# Altium schematic sheet BG1094_USB.SchDoc: =project_title
size Tabloid; PageSetup: Record=PageOptions|CenterHorizontal=True|CenterVertical=True|PrintScale=0.73|XCorrection=1.00|YCorrection=1.00|PrintKind=0|BorderSize=5000000|LeftOffset=0|BottomOffset=0|Orientation=2|PaperLength=1000|PaperWidth=1000|Scale=100|PaperSource=7|PrintQuality=-4|MediaType=1|DitherType=10|PaperKind=A4|PrintScaleMode=1; CompanyName: Luxonis Holding; Organization: Luxonis Holding; Address1: 1925 Harmony Park Drive; Address2: Westminster, CO; Address3: 80234; Address4: United States; SheetNumber: 4; SheetTotal: 5
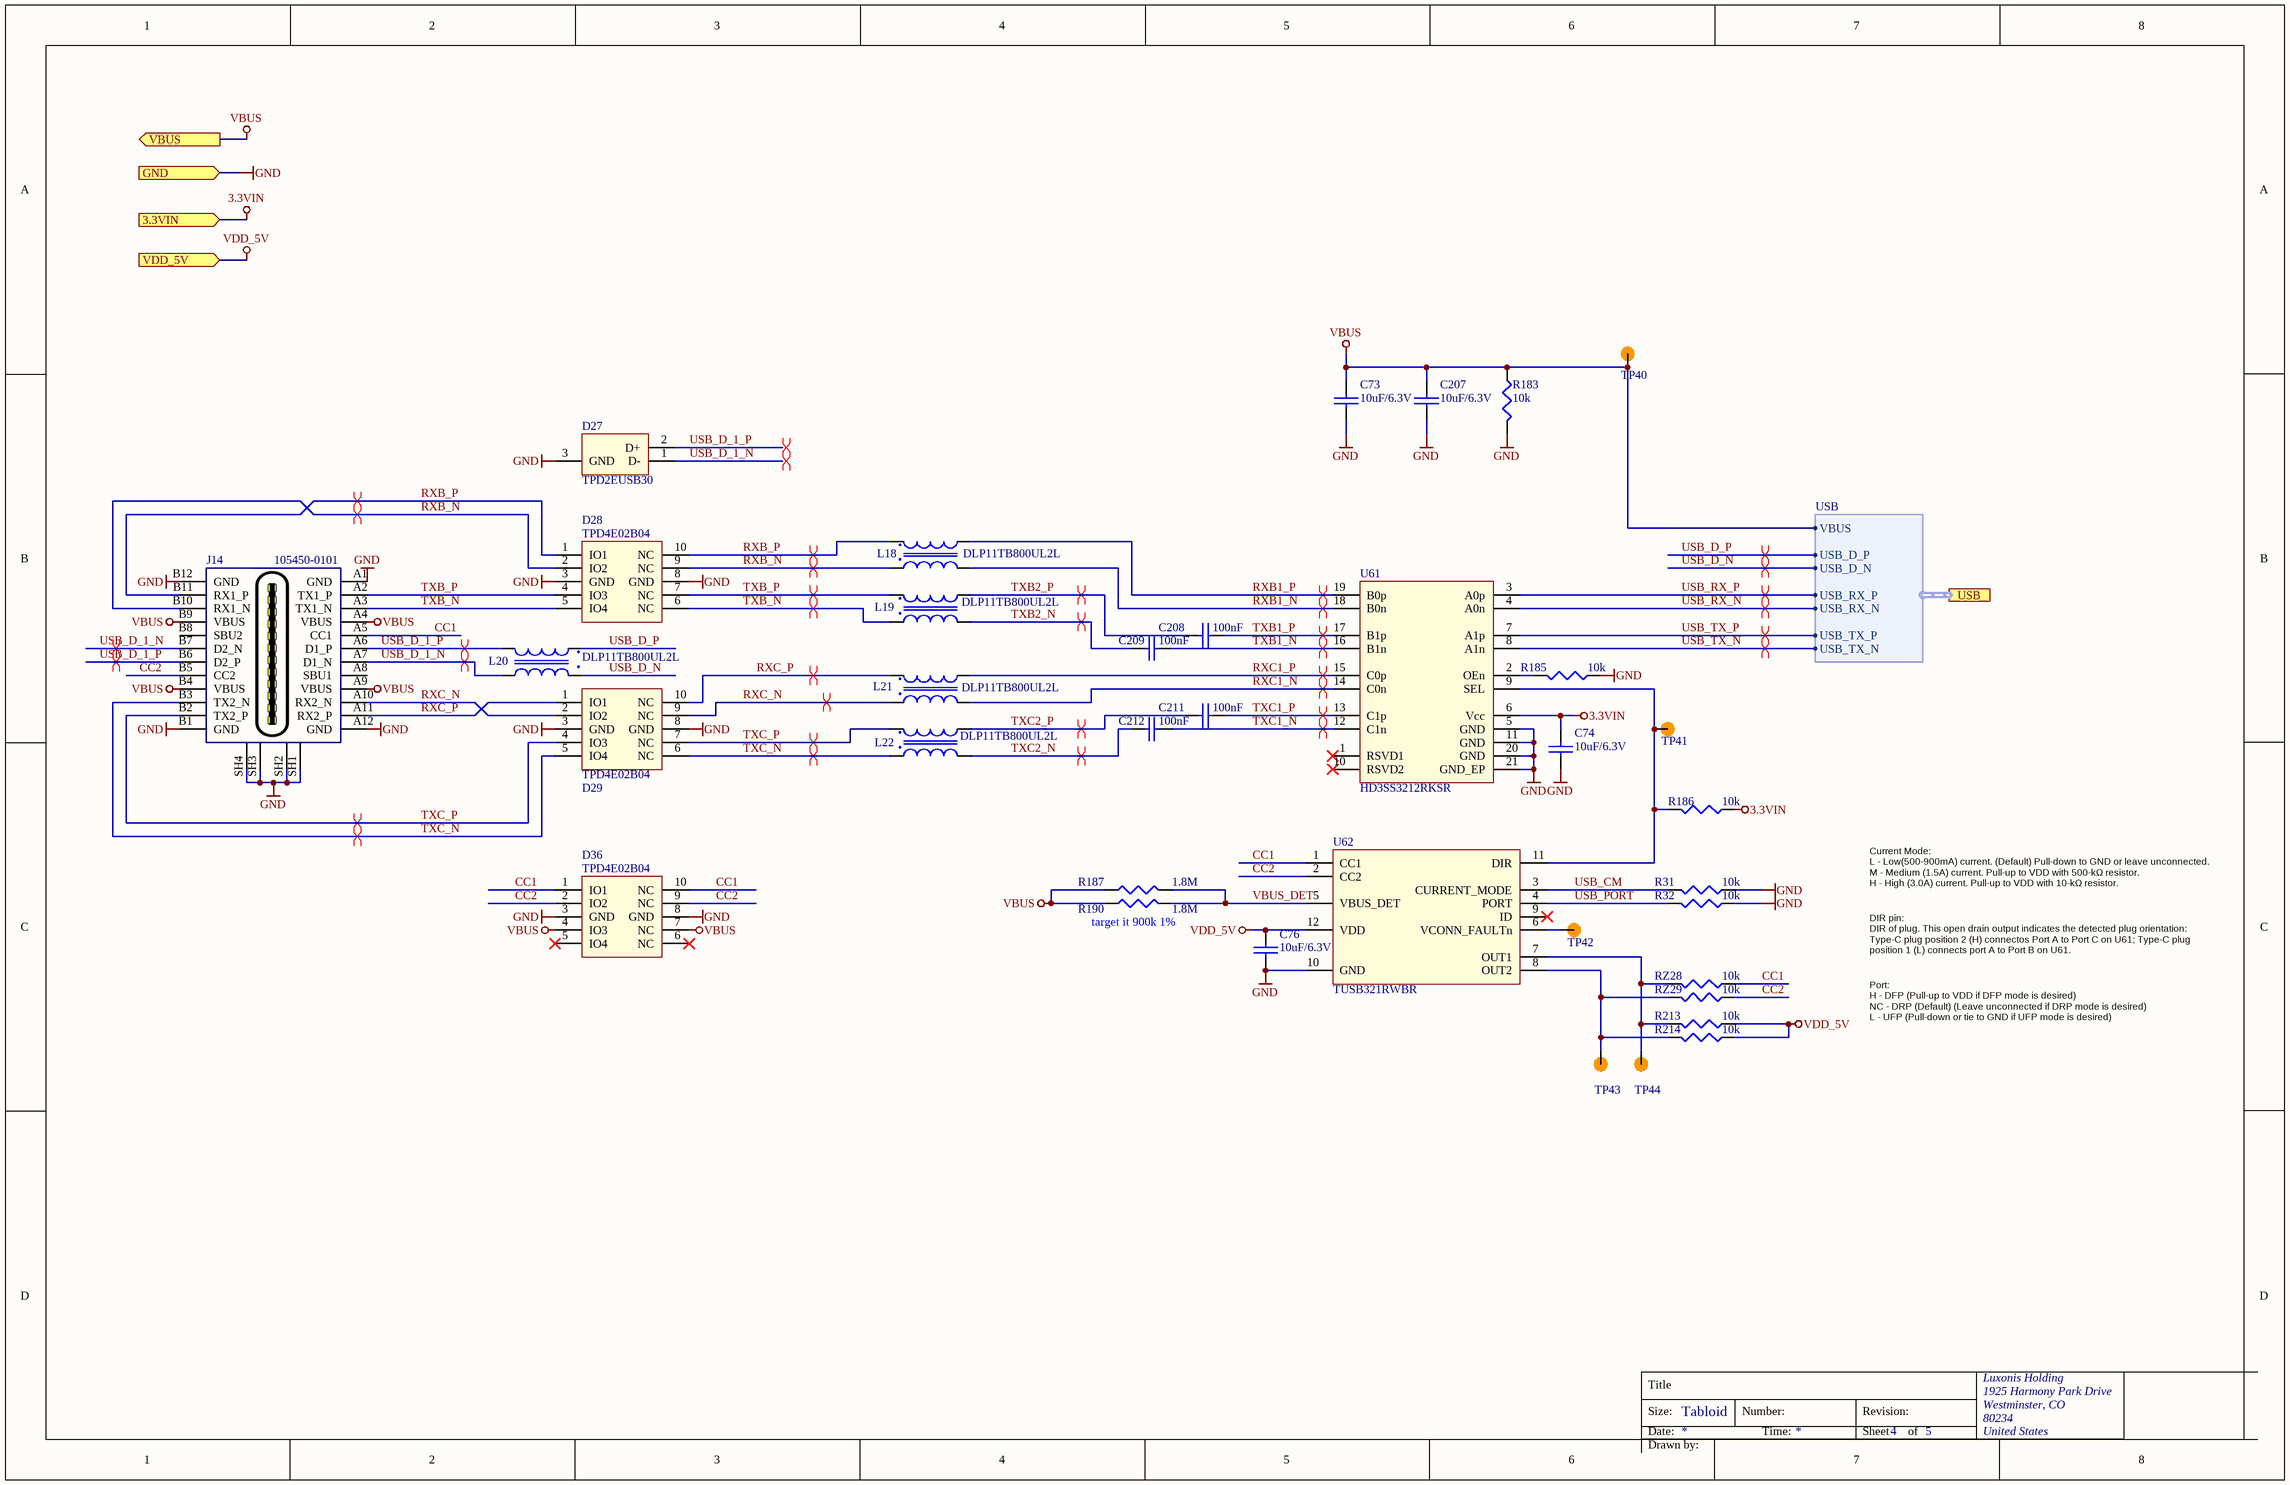
[diagram p0: BG1094_USB.SchDoc]

## Parts
C73  10uF/6.3V  [CAPC0402(1005)70_N]
C74  10uF/6.3V  [CAPC0402(1005)70_N]
C76  10uF/6.3V  [CAPC0402(1005)70_N]
C207  10uF/6.3V  [CAPC0402(1005)70_N]
C208  100nF  [CAPC0201(0603)33_L]
C209  100nF  [CAPC0201(0603)33_L]
C211  100nF  [CAPC0201(0603)33_L]
C212  100nF  [CAPC0201(0603)33_L]
D27  TPD2EUSB30  [SOT-3]
D28  TPD4E02B04  [DQA-10]
D29  TPD4E02B04  [DQA-10]
D36  TPD4E02B04  [DQA-10]
J14  105450-0101  [Molex_105450-0101]
L18  DLP11TB800UL2L  [CHOKE_0504]
L19  DLP11TB800UL2L  [CHOKE_0504]
L20  DLP11TB800UL2L  [CHOKE_0504]
L21  DLP11TB800UL2L  [CHOKE_0504]
L22  DLP11TB800UL2L  [CHOKE_0504]
R31  10k  [RESC0402(1005)_N]
R32  10k  [RESC0402(1005)_N]
R183  10k  [RESC0402(1005)_N]
R185  10k  [RESC0402(1005)_N]
R186  10k  [RESC0402(1005)_N]
R187  1.8M  [RESC0402(1005)_N]
R190  1.8M  [RESC0402(1005)_N]
R213  10k  [RESC0402(1005)_N]
R214  10k  [RESC0402(1005)_N]
RZ28  10k  [RESC0402(1005)_N]
RZ29  10k  [RESC0402(1005)_N]
TP40  TP_SMD  [TP_0.75MM_SMD_NO-SILK]  (value not drawn)  (no BOM)
TP41  TP_SMD  [TP_0.75MM_SMD_NO-SILK]  (value not drawn)  (no BOM)
TP42  TP_SMD  [TP_0.75MM_SMD_NO-SILK]  (value not drawn)  (no BOM)
TP43  TP_SMD  [TP_0.75MM_SMD_NO-SILK]  (value not drawn)  (no BOM)
TP44  TP_SMD  [TP_0.75MM_SMD_NO-SILK]  (value not drawn)  (no BOM)
U61  HD3SS3212RKSR  [VQFN-20]
U62  TUSB321RWBR  [X2QFN-12]

## Ports
3.3VIN (in), GND (in), USB (harness USB), VBUS (out), VDD_5V (in)

## Harnesses
USB: VBUS, USB_D_P, USB_D_N, USB_TX_N, USB_TX_P, USB_RX_N, USB_RX_P

## Nets
3.3VIN: C74.2 R186.2 U61.6(Vcc) ; port 3.3VIN
GND: C73.1 C74.1 C76.1 C207.1 D27.3(GND) D28.3(GND) D28.8(GND) D29.3(GND) D29.8(GND) D36.3(GND) D36.8(GND) J14.A1(GND) J14.A12(GND) J14.B1(GND) J14.B12(GND) J14.SH1(SH) J14.SH2(SH) J14.SH3(SH) J14.SH4(SH) R31.2 R32.2 R183.1 R185.2 U61.5(GND) U61.11(GND) U61.20(GND) U61.21(GND_EP) U62.10(GND) ; port GND
VBUS: C73.2 C207.2 D36.4(IO3) D36.7(NC) J14.A4(VBUS) J14.A9(VBUS) J14.B4(VBUS) J14.B9(VBUS) R183.2 R187.2 R190.2 TP40.1 ; port VBUS, port USB.VBUS
VDD_5V: C76.2 R213.2 R214.2 U62.12(VDD) ; port VDD_5V
CC1: D36.1(IO1) D36.10(NC) J14.A5(CC1) RZ28.1 U62.1(CC1)
CC2: D36.2(IO2) D36.9(NC) J14.B5(CC2) RZ29.1 U62.2(CC2)
RXB1_N: L18.4 U61.18(B0n)
RXB1_P: L18.2 U61.19(B0p)
RXB_N: D28.2(IO2) D28.9(NC) J14.B10(RX1_N) L18.3
RXB_P: D28.1(IO1) D28.10(NC) J14.B11(RX1_P) L18.1
RXC1_N: L21.4 U61.14(C0n)
RXC1_P: L21.2 U61.15(C0p)
RXC_N: D29.2(IO2) D29.9(NC) J14.A10(RX2_N) L21.3
RXC_P: D29.1(IO1) D29.10(NC) J14.A11(RX2_P) L21.1
TXB1_N: C209.1 U61.16(B1n)
TXB1_P: C208.1 U61.17(B1p)
TXB2_N: C209.2 L19.4
TXB2_P: C208.2 L19.2
TXB_N: D28.5(IO4) D28.6(NC) J14.A3(TX1_N) L19.3
TXB_P: D28.4(IO3) D28.7(NC) J14.A2(TX1_P) L19.1
TXC1_N: C212.1 U61.12(C1n)
TXC1_P: C211.1 U61.13(C1p)
TXC2_N: C212.2 L22.4
TXC2_P: C211.2 L22.2
TXC_N: D29.5(IO4) D29.6(NC) J14.B3(TX2_N) L22.3
TXC_P: D29.4(IO3) D29.7(NC) J14.B2(TX2_P) L22.1
USB_CM: R31.1 U62.3(CURRENT_MODE)
USB_D_1_N: D27.1(D-) J14.A7(D1_N) J14.B7(D2_N) L20.4
USB_D_1_P: D27.2(D+) J14.A6(D1_P) J14.B6(D2_P) L20.2
USB_D_N: L20.3 ; port USB.USB_D_N
USB_D_P: L20.1 ; port USB.USB_D_P
USB_PORT: R32.1 U62.4(PORT)
USB_RX_N: U61.4(A0n) ; port USB.USB_RX_N
USB_RX_P: U61.3(A0p) ; port USB.USB_RX_P
USB_TX_N: U61.8(A1n) ; port USB.USB_TX_N
USB_TX_P: U61.7(A1p) ; port USB.USB_TX_P
VBUS_DET: R187.1 R190.1 U62.5(VBUS_DET)
NetR185_1: R185.1 U61.2(OEn)
NetR186_1: R186.1 TP41.1 U61.9(SEL) U62.11(DIR)
NetR213_1: R213.1 RZ28.2 TP44.1 U62.7(OUT1)
NetR214_1: R214.1 RZ29.2 TP43.1 U62.8(OUT2)
NetTP42_1: TP42.1 U62.6(VCONN_FAULTn)

Not connected (* = marked no-connect by the designer): D36 5(IO4)* 6(NC)*; J14 A8(SBU1) B8(SBU2); U61 1(RSVD1)* 10(RSVD2)*; U62 9(ID)*

## Layout directives
differential pair; differential pair class USB3: RXB1_N, RXB1_P, RXB_N, RXB_P, RXC1_N, RXC1_P, RXC_N, RXC_P, TXB1_N, TXB1_P, TXB2_N, TXB2_P, TXB_N, TXB_P, TXC1_N, TXC1_P, TXC2_N, TXC2_P, TXC_N, TXC_P, USB_D_1_N, USB_D_1_P, USB_D_N, USB_D_P, USB_RX_N, USB_RX_P, USB_TX_N, USB_TX_P

## Notes on the sheet
- Current Mode:
  L - Low(500-900mA) current. (Default) Pull-down to GND or leave unconnected.
  M - Medium (1.5A) current. Pull-up to VDD with 500-kΩ resistor.
  H - High (3.0A) current. Pull-up to VDD with 10-kΩ resistor.
- (near R190) target it 900k 1%
- DIR pin:
  DIR of plug. This open drain output indicates the detected plug orientation: Type-C plug position 2 (H) connectos Port A to Port C on U61; Type-C plug position 1 (L) connects port A to Port B on U61.
- Port:
  H - DFP (Pull-up to VDD if DFP mode is desired)
  NC - DRP (Default) (Leave unconnected if DRP mode is desired)
  L - UFP (Pull-down or tie to GND if UFP mode is desired)
- Title
- Size:
- Date:
- Tabloid
- Number:
- Time:
- Revision:
- Sheet
- of
- Drawn by:
- (in symbol DLP11TB800UL2L) .

## Library data of the parts
C73 C74 C76 C207 = CAP: SMD Multilayer Ceramic Capacitor, 0402 [1005 Metric], 10 µF, 6.3 V, ± 20%, X5R; MAN: MuRata; MAN PN: GRM155R60J106ME44D; ICCO PN: MV226007; DIST: Farnell; DIST PN: 2218854RL
C208 C209 C211 C212 = CAP: SMD Multilayer Ceramic Capacitor, 0201 [0603 Metric], 0.1 µF, 6.3 V, ± 10%, X5R; B - Value: 0.1uF; C - Notes: 0201  0.1 µF, 6.3 V, ± 10%, X5R; E - MFG: MuRata; F - MFG P/N: GRM033R60J104KE19D; D - my Footprint: CAPC0201(0603)33_L
D27 = TPD2EUSB30: DIODE, ESD, DUAL, USB3.0, SOT-3; E - MFG: TI; F - MFG P/N: TPD2EUSB30ADRTR; D - my Footprint: SOT-3
D28 D29 D36 = TPD4E02B04: TVS DIODE 3.6VWM 8.8VC 10USON; E - MFG: TI; F - MFG P/N: TPD4E02B04DQAR; D - my Footprint: DQA-10
J14 = Molex_1054500101: USB 3.1 Type C Receptacle SMD RA; E - MFG: Molex; D - my Footprint: Molex_105450-0101; F - MFG P/N: 105450-0101
L18-L22 = DLP11TB800UL2L: CMC 150MA 2LN 80 OHM SMD; E - MFG: MuRata; D - my Footprint: CHOKE_0504; F - MFG P/N: DLP11TB800UL2L
R31 R32 R183 R185 R186 R213 R214 RZ28 RZ29 = RES1: SMD Chip Resistor, Thick Film, 10 kohm, 50 V, 0402, 100mW, ± 1%; MAN: Panasonic; MAN PN: ERJ2RKF1002X; ICCO PN: M2V00015; DIST: Farnell; DIST PN: 2397284
R187 R190 = R_1.8M_1%_0402: RES SMD 1.8M 1% 0402 50V; E - MFG: YAGEO (PHYCOMP); F - MFG P/N: RC0402FR-071M8L; D - my Footprint: RESC0402(1005)_N
TP40-TP44 = TP_SMD: circular pad test point, SMD
U61 = HD3SS3212RKSR: Two Channel Differential 2:1/1:2 10Gbps Mux/Demux; E - MFG: TEXAS INSTRUMENTS; D - my Footprint: VQFN-20; F - MFG P/N: HD3SS3212RKSR
U62 = TUSB321RWBR: USB Type-C  ™ Configuration  Channel  Logic and Port Control  with VCONN; E - MFG: TI; D - my Footprint: X2QFN-12; F - MFG P/N: TUSB321RWBR